# Altium schematic sheet power-supplies.SchDoc
size B
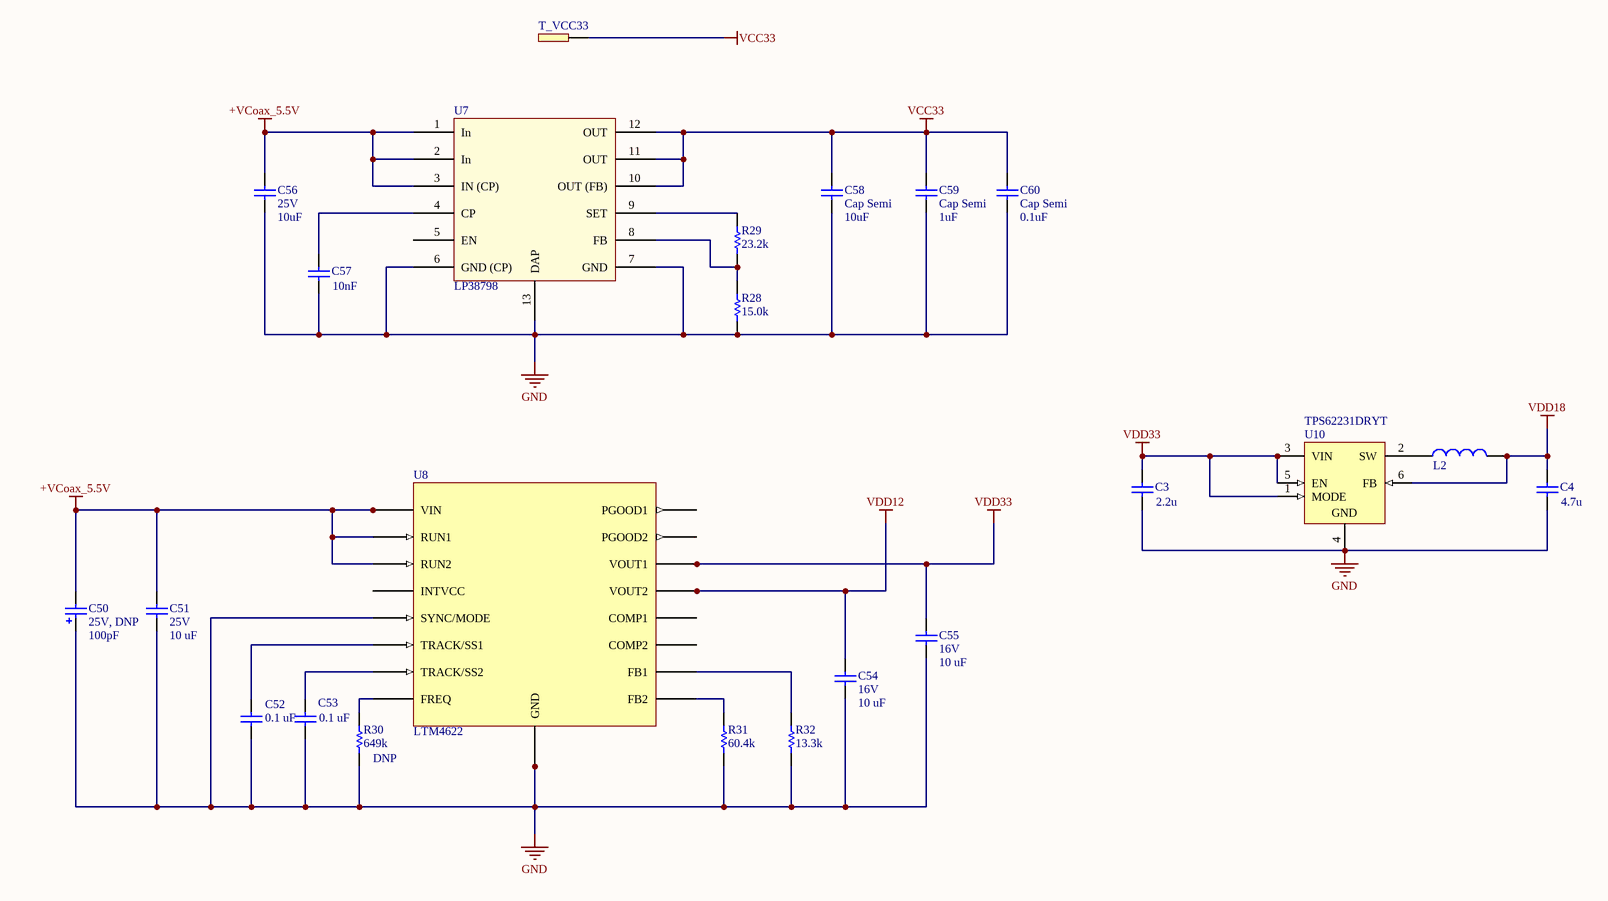
[diagram p0: power-supplies.SchDoc]

## Parts
C3  value 2.2u  [Cap_0402]  (hidden comment: X7R Ceramic)
C4  value 4.7u  [Cap_0402]  (hidden comment: X7R Ceramic)
C50  25V, DNP  value 100pF  [C0805]
C51  25V  value 10 uF  [C1206]
C52  value 0.1 uF  [C1206]  (hidden comment: 25V)
C53  value 0.1 uF  [C1206]  (hidden comment: 25V)
C54  16V  value 10 uF  [C1206]
C55  16V  value 10 uF  [C1206]
C56  25V  value 10uF  [C1206]
C57  value 10nF  [0402]
C58  Cap Semi  value 10uF  [Cap-0603]
C59  Cap Semi  value 1uF  [Cap-0603]
C60  Cap Semi  value 0.1uF  [Cap-0603]
L2  Ferrite Bead  [LQM21PN2R2MC0D]  (value not drawn)
R28  value 15.0k  [Res_0402]  (hidden comment: Res1)
R29  value 23.2k  [Res_0402]  (hidden comment: Res1)
R30  DNP  value 649k  [Res_0402]
R31  value 60.4k  [Res_0402]  (hidden comment: 649k (DNP))
R32  value 13.3k  [Res_0402]
T_VCC33  Header_1PIN  [JUMPER1PIN]  (value not drawn)
U7  LP38798  [DFN12]
U8  LTM4622  [LGA5x5]
U10  TPS62231DRYT  [TPS62231DRYT]

## Nets
+VCoax_5.5V: C50.2 C51.2 C56.2 U7.1(In) U7.2(In) U7.3(IN_(CP)) U8.A2(VIN) U8.B2(RUN2) U8.B3(VIN) U8.D2(RUN1) U8.D3(VIN) U8.E2(VIN)
GND: C3.1 C4.1 C50.1 C51.1 C52.1 C53.1 C54.1 C55.1 C56.1 C57.1 C58.1 C59.1 C60.1 R28.2 R30.2 R31.2 R32.2 U7.6(GND_(CP)) U7.7(GND) U7.13(DAP) U8.B5(GND) U8.C1(GND) U8.C2(GND) U8.C5(SYNC/MODE) U8.D5(GND) U10.4(GND)
VCC33: C58.2 C59.2 C60.2 T_VCC33.0 U7.10(OUT_(FB)) U7.11(OUT) U7.12(OUT)
VDD12: C54.2 U8.A1(VOUT2) U8.B1(VOUT2)
VDD18: C4.2 L2.2 U10.6(FB)
VDD33: C3.2 C55.2 U8.D1(VOUT1) U8.E1(VOUT1) U10.1(MODE) U10.3(VIN) U10.5(EN)
NetC52_2: C52.2 U8.E5(TRACK/SS1)
NetC53_2: C53.2 U8.A3(TRACK/SS2)
NetC57_2: C57.2 U7.4(CP)
NetL2_1: L2.1 U10.2(SW)
NetR28_1: R28.1 R29.2 U7.8(FB)
NetR29_1: R29.1 U7.9(SET)
NetR30_1: R30.1 U8.C4(FREQ)
NetR31_1: R31.1 U8.A4(FB2)
NetR32_1: R32.1 U8.E4(FB1)

Not connected (* = marked no-connect by the designer): U7 5(EN); U8 A5(COMP2) B4(PGOOD2) C3(INTVCC) D4(PGOOD1)

## Library data of the parts
C3 C4 = Cap: Capacitor; Published: 8-Jun-2000; LatestRevisionDate: 17-Jul-2002; LatestRevisionNote: Re-released for DXP Platform.; PackageReference: RAD-0.3; Publisher: Altium Limited; PackageDescription: Radial Cap, Thru-Hole; 2 Leads; 0.3 in Pin Spacing
C50 = Cap Pol3: Polarized Capacitor (Surface Mount); Published: 8-Jun-2000; LatestRevisionDate: 29-May-2009; LatestRevisionNote: IPC-7351 Footprint Added.; PackageReference: C0805; Publisher: Altium Limited; PackageDescription: Chip Capacitor
C51-C60 = Cap Semi: Capacitor (Semiconductor SIM Model); Published: 8-Jun-2000; LatestRevisionDate: 29-May-2009; LatestRevisionNote: IPC-7351 Footprint Added.; PackageReference: C1206; Publisher: Altium Limited; PackageDescription: Chip Capacitor
  C51-C53: Voltage: 25 V
  C54 C55: Voltage: 16 V
R28-R32 = Res1: Resistor; Published: 8-Jun-2000; LatestRevisionDate: 17-Jul-2002; LatestRevisionNote: Re-released for DXP Platform.; PackageReference: AXIAL-0.3; Publisher: Altium Limited; PackageDescription: Axial Device, Thru-Hole; 2 Leads; 0.3 in Pin Spacing
U7 = Component_1: Low Noise Positive LDO
U10 = TPS62231DRYT: Buck Step Down Regulator with 2.05 to 6 V Input and 1.8 V Output, -40 to 85 degC, 6-Pin SON (DRY), Green (RoHS & no Sb/Br); Manufacturer: Texas Instruments; Duty Cycle(Max)(%): 100; Iout(Max)(A): 0.5; Iq(Typ)(mA): 0.022; Preset Vout(V): 1.8; Rating: Catalog; Regulated Outputs(#): 1; SubFamily: Step-Down Regulator; Switch Current Limit(Typ)(A): 0.84; Synchronous Rectification: TRUE; Vin(Max)(V): 6; Vin(Min)(V): 2.05; DatasheetVersion: SLVS941E; PackageVersion: revF, Dec-2011; PackageReference: DRY6; PackageDescription: 6-Pin Plastic Small Outline No-Lead, 1 x 1.45 x 0.6 mm Body, 0.5 mm Pitch; Supplier 1: Digi-Key; Supplier Part Number 1: 296-24485-2-ND; Supplier 2: Digi-Key; Supplier Part Number 2: 296-24485-1-ND; Supplier 3: Digi-Key; Supplier Part Number 3: 296-24485-6-ND; Supplier 4: Farnell; Supplier Part Number 4: 1735598; Supplier 5: Newark; Supplier Part Number 5: 07R8108; Supplier 6: Mouser; Supplier Part Number 6: 595-TPS62231DRYT; Eco-Plan: Green (RoHS & no Sb/Br); Topology: Buck; Vout(Max)(V): 1.8; Vout(Min)(V): 1.8; Mounting Technology: Surface Mount; PartNumber: TPS62231DRYT; ComponentLink1Description: Datasheet; ComponentLink1URL: http://www.ti.com/general/docs/lit/getliterature.tsp?genericPartNumber=TPS62231&fileType=pdf; ComponentLink2Description: Package Specification; ComponentLink2URL: http://www.ti.com/litv/pdf/mpds221e; ComponentLink3Description: URL Link1; ComponentLink3URL: Samples URL:http://www.ti.com/product/tps62231#samples